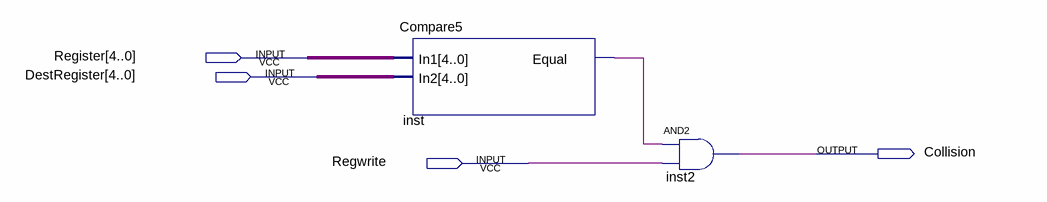
[diagram p0: schematic sheet]
// Quartus schematic CDU.bdf as structural Verilog: 2 symbols, 4 pins
module CDU (
  input  [4:0] Register,
  input  [4:0] DestRegister,
  input  Regwrite,
  output Collision
);

  wire inst_equal;

  Compare5 inst (.In1(Register), .In2(DestRegister), .Equal(inst_equal));
  and inst2 (Collision, inst_equal, Regwrite);
endmodule
